# EAGLE design PlatLampCon_v1 (EAGLE 9.6.2)
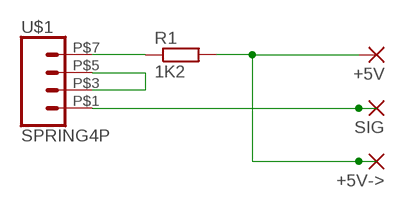
[diagram p0: schematic, sheet 1]

## Parts
+5V  2,15/1,0  [2,15/1,0]
+5V->  2,15/1,0  [2,15/1,0]
R1  1K2  R-EU_0207/7  [0207/7]
SIG  2,15/1,0  [2,15/1,0]
U$1  SPRING4P  [SPRING-CON4P]

## Nets
N$1: +5V->.1(P) +5V.1(P) R1.2
N$2: R1.1 U$1.P$7
N$3: U$1.P$3 U$1.P$5
N$4: SIG.1(P) U$1.P$1

## Library data of the parts
+5V +5V-> SIG = wirepad:2,15/1,0: THROUGH-HOLE PAD
R1 = rcl:R-EU_: RESISTOR, European symbol; SPICEPREFIX: R
U$1 = TimsZero:SPRING4P: 4x2 Spring Connector

## Board
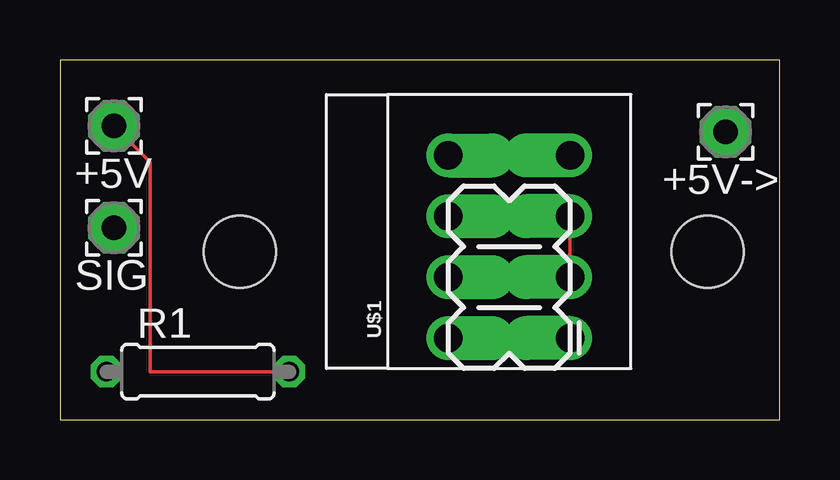
[diagram p1: board, top side]
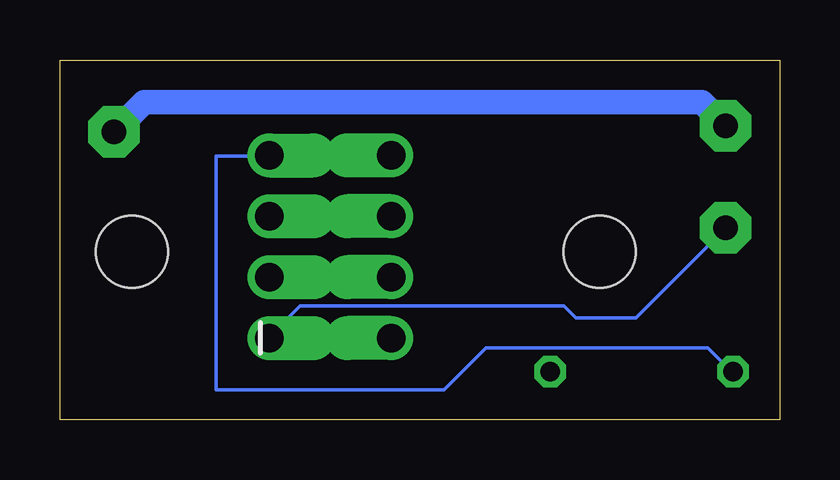
[diagram p2: board, bottom side, seen from below]

Size 30 x 15 mm. Coordinates in mm from the lower left corner, seen from the top.
Outline: 0,0 30,0 30,15 0,15 0,0
Copper layers (1*16): Top 0.035mm / dielectric 1.5mm / Bottom 0.035mm
Design rules "default": minimum track width 6mil, minimum drill 0.35mm, track to track 6mil, track to pad 6mil, pad to pad 6mil, via to via 6mil, smd to smd 6mil, copper to edge 40mil, drill to drill 6mil, minimum pad ring 10mil, minimum via ring 8mil, stop-mask expansion 4mil, vias tented up to drill 0mil, thermal gap 10mil
Holes 3 mm at 7.5,7 27,7

### Footprints (pad centres in the part's own frame; a part is rotated, then mirrored left to right if it is on the bottom)
2,15/1,0 = drill 1.016 pad 2.159 octagon: 1 0,0
0207/7 = drill 0.813 octagon: 1 -3.81,0; 2 3.81,0
SPRING-CON4P = drill 1.2 pad 1.829 offset: P$1 0,-1.27; P$2 0,3.81; P$3 2.54,-1.27; P$4 2.54,3.81; P$5 5.08,-1.27; P$6 5.08,3.81; P$7 7.62,-1.27; P$8 7.62,3.81

### Placement (x,y rotation side)
+5V  2.25,12.25 0 top
+5V->  27.75,12 0 top
R1  5.75,2 0 top
SIG  2.25,8 0 top
U$1  20,3.4 90 top

### Tracks (layer width: path | path; a pad name or v marks a point on that pad's centre or on a via)
N$1
  Top 0.152: R1.2 3.75,2 3.75,10.75 +5V.1
  Bottom 1.016: +5V->.1 26.5,13.25 3.25,13.25 +5V.1
N$2
  Bottom 0.152: R1.1 2,2 3,3 12.25,3 14,1.25 23.5,1.25 23.5,11 21.5,11 U$1.P$7
N$3
  Top 0.152: U$1.P$3 21.25,6 21.25,8.25 U$1.P$5
N$4
  Bottom 0.152: SIG.1 6,4.25 8.5,4.25 9,4.75 20,4.75 21.25,3.5 U$1.P$1